# Altium schematic sheet Buzzer_and_Solenoid.SchDoc: SPEX - INTERFACE - BUZZER
size A4; Author: Derek Belsky; Revision: 0; SheetNumber: 5; SheetTotal: 6
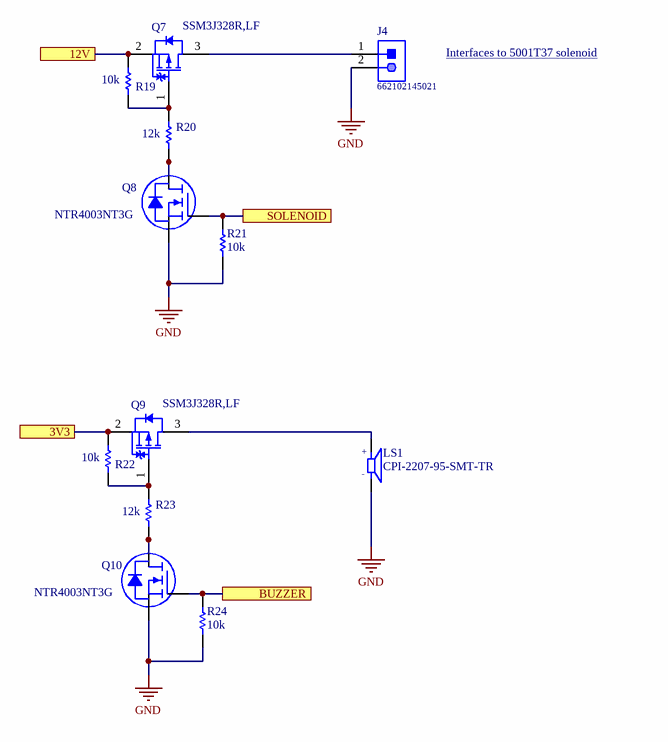
[diagram p0: Buzzer_and_Solenoid.SchDoc]

## Parts
J4  662102145021  [662102145021]
LS1  CPI-2207-95-SMT-TR  [XDCR_CPI-2207-95-SMT-TR]
Q7  SSM3J328R,LF  [TOSH-SOT-23F_V]
Q8  NTR4003NT3G  [ON SEMI SOT-23-3]
Q9  SSM3J328R,LF  [TOSH-SOT-23F_V]
Q10  NTR4003NT3G  [ON SEMI SOT-23-3]
R19  value 10k  [RESC1609X50X30NL8T20]  (hidden comment: CRCW060310K0FKEA)
R20  value 12k  [RESC1609X50X30LL10T20]  (hidden comment: CRCW060312K0FKEA)
R21  value 10k  [RESC1609X50X30NL8T20]  (hidden comment: CRCW060310K0FKEA)
R22  value 10k  [RESC1609X50X30NL8T20]  (hidden comment: CRCW060310K0FKEA)
R23  value 12k  [RESC1609X50X30LL10T20]  (hidden comment: CRCW060312K0FKEA)
R24  value 10k  [RESC1609X50X30NL8T20]  (hidden comment: CRCW060310K0FKEA)

## Ports
3V3, 12V, BUZZER, SOLENOID

## Nets
GND: J4.2 LS1.N Q8.2(S) Q10.2(S) R21.2 R24.2
3V3: Q9.2(S) R22.2 ; port 3V3
12V: Q7.2(S) R19.2 ; port 12V
BUZZER: Q10.1(G) R24.1 ; port BUZZER
SOLENOID: Q8.1(G) R21.1 ; port SOLENOID
NetJ4_1: J4.1 Q7.3(D)
NetLS1_P: LS1.P Q9.3(D)
NetQ7_1: Q7.1(G) R19.1 R20.2
NetQ8_3: Q8.3(D) R20.1
NetQ9_1: Q9.1(G) R22.1 R23.2
NetQ10_3: Q10.3(D) R23.1

## Notes on the sheet
- Interfaces to 5001T37 solenoid <https://www.mcmaster.com/5001t37>
- Title
- Size:
- Date:
- A4
- Author:
- Time:
- Sheet
- Revision:
- of
- RIT Space Exploration Team
- Rochester Institute of Technology
- 1 Lomb Memorial Drive
- Rochester, NY 14623
- https://spex.rit.edu
- File:
- (in symbol CPI-2207-95-SMT-TR) +; -

## Library data of the parts
J4 = CMP-1502-00482-1: SMT Male Header WR-MPC3, with SMT Solder Tabs, Right Angled, Single Row, pitch 3 mm, 2 pins; Manufacturer: Wurth Elektronik; Contact Resistance: 10mOhm; Working Voltage: 250VAC; Pitch: 3mm; Pin Number: 2; Mounting Technology: SMT; Orientation: RightAngled; Part Number: 662102145021; Datasheet URL: https://katalog.we-online.de/em/datasheet/6621xx145021.pdf; Manufacturer URL: http://www.we-online.de; Packaging: TapeandReel; Publisher: WurthElektronik; Gender: Male; Operating Temperature: -40to105degC; Package Reference: 662102145021
LS1 = CPI-2207-95-SMT-TR: 22.1 mm, 12 Vdc, 95 dB, Surface Mount, Driving Circuit, Piezo Audio Indicator Buzzer; MF: CUI Devices; CUI_purchase_URL: https://www.cuidevices.com/product/audio/buzzers/audio-indicators/cpi-2207-95-smt-tr?utm_source=snapeda.com&utm_medium=referral&utm_campaign=snapedaBOM; Digi-Key_Purchase_URL: https://www.digikey.com/product-detail/en/cui-devices/CPI-2207-95-SMT-TR/2223-CPI-2207-95-SMT-CT-ND/11591340?utm_source=snapeda&utm_medium=aggregator&utm_campaign=symbol; Digi-Key_Part_Number: 2223-CPI-2207-95-SMT-CT-ND; Package: CUI Devices; Value: *; SnapEDA_Link: https://www.snapeda.com/parts/CPI-2207-95-SMT-TR/CUI%20Devices/view-part/4502466/?ref=snap; MP: CPI-2207-95-SMT-TR
Q7 Q9 = CMP-2100-03686-1: TOSHIBA Field-Effect Transistor Silicon P-Channel MOS Type (U-MOS VI), 20 V, -55 to 125 degC, 3-Pin SOTFL, RoHS, Tape and Reel; Gate to Source Voltage (Vgs): 8V; Drain to Source Breakdown Voltage: -20V; Turn-Off Delay Time: 107ns; Continuous Drain Current (ID): 6A; Rds On Max: 29.8mOhm; Number of Elements: 1; Turn-On Delay Time: 32ns; Drain to Source Resistance: 47.4mOhm; Drain to Source Voltage (Vdss): 20V; Power Dissipation: 2W; Element Configuration: Single; Max Power Dissipation: 1W; Input Capacitance: 840pF; Manufacturer URL: http://www.toshiba.com/; Number of Pins: 3; Number of Channels: 1; Max Operating Temperature: 150degC; Min Operating Temperature: -55degC; Manufacturer: Toshiba; Mount: SurfaceMount; Package Description: 3-Pin Small Outline Transistor, Flat Lead, Body 2.9 x 1.8 mm, Pitch 0.95 mm; Radiation Hardening: No; Package Quantity: 3000; Package Reference: SOT-23F; RoHSCompliant: true; Package URL: https://toshiba.semicon-storage.com/ap-en/design-support/package/detail.SOT-23F.html; Packaging: TapeandReel; Datasheet Version: 41699.0; Case/Package: SOT-23-3; Datasheet URL: https://toshiba.semicon-storage.com/info/docget.jsp?did=2429&prodName=SSM3J328R
Q8 Q10 = NTR4003NT3G: MOSFET N-CH 30V 500MA SOT-23; Manufacturer: ON Semiconductor; Current - Continuous Drain (Id) @ 25°C: 500mA (Ta); Drive Voltage (Max Rds On,  Min Rds On): 2.5V, 4V; FET Type: N-Channel; Gate Charge (Qg) (Max) @ Vgs: 1.15nC @ 5V; Input Capacitance (Ciss) (Max) @ Vds: 21pF @ 5V; Power Dissipation (Max): 690mW (Ta); Rds On (Max) @ Id, Vgs: 1.5Ohm @ 10mA, 4V; Vgs (Max): ±20V; Vgs(th) (Max) @ Id: 1.4V @ 250µA; Part Number: NTR4003NT3G; ComponentLink1Description: Datasheet; ComponentLink1URL: http://www.onsemi.com/pub/Collateral/NTR4003N-D.PDF; ComponentLink2Description: DigiKey Link; ComponentLink2URL: http://digikey.com/product-detail/en/on-semiconductor/NTR4003NT3G/NTR4003NT3GOSCT-ND/1967271; Device Package: TO-236-3, SC-59, SOT-23-3; Drain to Source Voltage (Vdss): 30V; LastUpdated: 1/21/2020 4:01:12 AM; Lifecycle Status: Active; Minimum Order: 1; Mounting Type: Surface Mount; Operating Temperature: -55°C ~ 150°C (TJ); Package / Case: TO-236-3, SC-59, SOT-23-3; Packaging: TapeAndReel; Part Status: Active; Price: 0.04; Series: -; Supplier 1: DigiKey; Supplier Part Number 1: NTR4003NT3GOSCT-ND; Supplier Device Package: SOT-23-3 (TO-236); Technology: MOSFET (Metal Oxide)
R19 R21 R22 R24 = CMP-1666-00005-4: Chip Resistor, 10 KOhm, +/- 1%, 100 mW, -55 to 155 degC, 0603 (1608 Metric), RoHS, Tape and Reel; Manufacturer: Vishay Semiconductor; Voltage Rating: 75 V; Max Operating Temperature: 155 degC; PackageDescription: 2-Pin Surface Mount Device, Body 1.575 x 0.85 mm; ComponentLink1Description: Manufacturer URL; RoHSCompliant: true; PackageReference: 0603; REACH SVHC: Unknown; Length: 1.55 mm; DatasheetVersion: 06/2012; Packaging: Tape and Reel; Min Operating Temperature: -55 degC; Mounting Technology: Surface Mount; ComponentLink2URL: https://datasheet.ciiva.com/11809/0900766b80d98afc-11809037.pdf; Height: 0.45 mm; ComponentLink2Description: Datasheet; Package Quantity: 5000; ComponentLink1URL: http://www.vishay.com/
R20 R23 = CMP-2000-03877-1: Manufacturer: Vishay Dale; Part Number: CRCW060312K0FKEA